# EAGLE design DoorchimeCR2B (EAGLE 6.5.0)

## Sheet 1 of 3
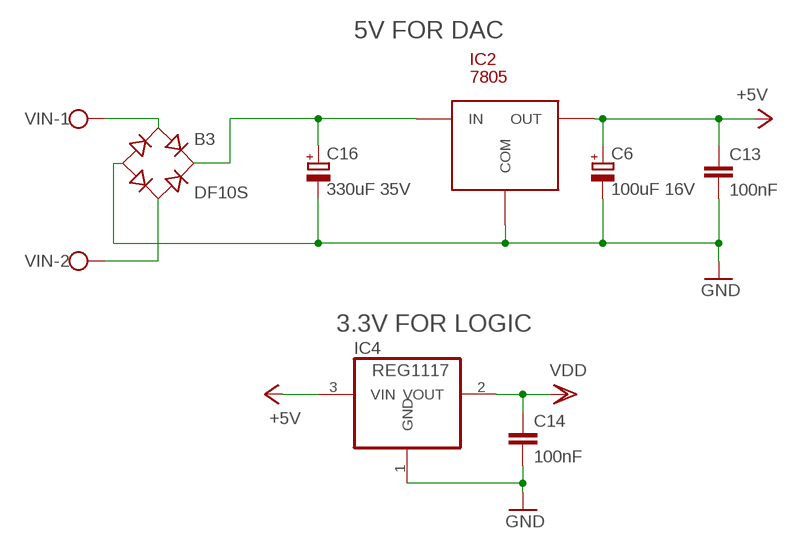
[diagram p0: schematic, sheet 1]

### Parts
B3  DF10S  [DFS]
C6  100uF 16V  CPOL-EU153CLV-0605  [153CLV-0605]
C13  100nF  C-EUC0603  [C0603]
C14  100nF  C-EUC0603  [C0603]
C16  330uF 35V  CPOL-EU153CLV-0807  [153CLV-0807]
IC2  7805  78XX-D2PAK  [D2PAK]
IC4  REG1117  [SOT223]
VIN  W237-102  [W237-102]

### Nets
+5V: C6.+ C13.1 IC2.OUT IC4.3(VIN) ; also sheet 3
GND [analog_pwr]: B3.- C6.- C13.2 C14.2 C16.- IC2.COM IC4.1(GND) ; also sheet 2,3
VDD: C14.1 IC4.2(VOUT) ; also sheet 2
VIN1 [system_pwr]: B3.AC1 VIN.1
VIN2: B3.AC2 VIN.2
VIN+: B3.+ C16.+ IC2.IN

### Notes on the sheet
- 5V FOR DAC
- 3.3V FOR LOGIC

## Sheet 2 of 3: Logic
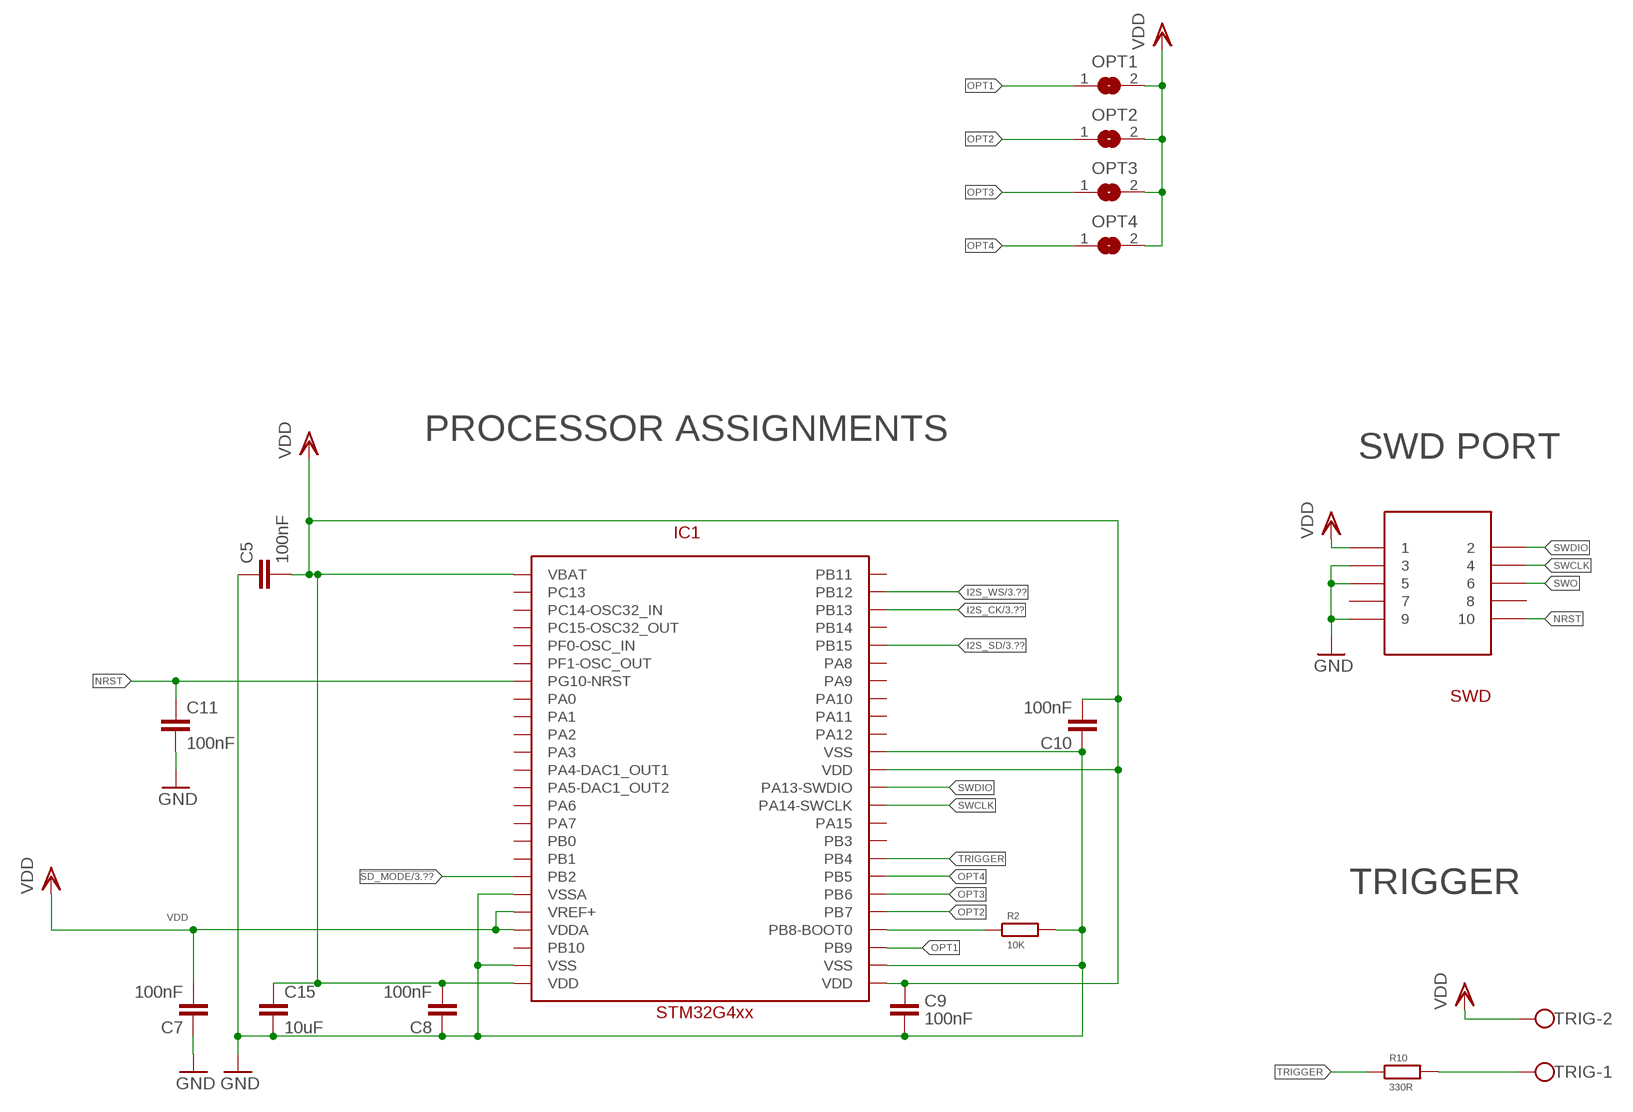
[diagram p1: schematic, sheet 2]

### Parts
C5  100nF  C-EUC0603  [C0603]
C7  100nF  C-EUC0603  [C0603]
C8  100nF  C-EUC0603  [C0603]
C9  100nF  C-EUC0603  [C0603]
C10  100nF  C-EUC0603  [C0603]
C11  100nF  C-EUC0603  [C0603]
C15  10uF  C-EUC0603  [C0603]
IC1  STM32G4xx  STM32G431-C8T6  [TQFP48]
OPT1  SJ  [SJ]
OPT2  SJ  [SJ]
OPT3  SJ  [SJ]
OPT4  SJ  [SJ]
R2  10K  R-EU_R0603  [R0603]
R10  330R  R-EU_R0603  [R0603]
SWD  FTSH-105-01  [FTSH-105-01-XXX-DV-K]
TRIG  W237-102  [W237-102]

### Nets
!SD_MODE: IC1.PB2 ; also sheet 3
BOOT0: IC1.PB8-BOOT0 R2.1
GND [analog_pwr]: C5.1 C7.1 C8.1 C9.1 C10.1 C11.2 C15.2 IC1.VSS@23(VSS) IC1.VSS@35(VSS) IC1.VSS@47(VSS) IC1.VSSA R2.2 SWD.3 SWD.5 SWD.9 ; also sheet 1,3
I2S_CK: IC1.PB13 ; also sheet 3
I2S_SD: IC1.PB15 ; also sheet 3
I2S_WS: IC1.PB12 ; also sheet 3
NRST: C11.1 IC1.PG10-NRST SWD.10
OPT1: IC1.PB9 OPT1.1
OPT2: IC1.PB7 OPT2.1
OPT3: IC1.PB6 OPT3.1
OPT4: IC1.PB5 OPT4.1
SWCLK: IC1.PA14-SWCLK SWD.4
SWDIO: IC1.PA13-SWDIO SWD.2
SWO: SWD.6
TRIG1: R10.2 TRIG.1
TRIGGER: IC1.PB4 R10.1
VDD: C5.2 C7.2 C8.2 C9.2 C10.2 C15.1 IC1.VBAT IC1.VDD@24(VDD) IC1.VDD@36(VDD) IC1.VDD@48(VDD) IC1.VDDA IC1.VREF+ OPT1.2 OPT2.2 OPT3.2 OPT4.2 SWD.1 TRIG.2 ; also sheet 1
Unconnected: IC1.PA0 IC1.PA1 IC1.PA2 IC1.PA3 IC1.PA4-DAC1_OUT1 IC1.PA5-DAC1_OUT2 IC1.PA6 IC1.PA7 IC1.PA8 IC1.PA9 IC1.PA10 IC1.PA11 IC1.PA12 IC1.PA15 IC1.PB0 IC1.PB1 IC1.PB3 IC1.PB10 IC1.PB11 IC1.PB14 IC1.PC13 IC1.PC14-OSC32_IN IC1.PC15-OSC32_OUT IC1.PF0-OSC_IN IC1.PF1-OSC_OUT SWD.7 SWD.8

### Notes on the sheet
- PROCESSOR ASSIGNMENTS
- SWD PORT
- TRIGGER

## Sheet 3 of 3: Speaker Output
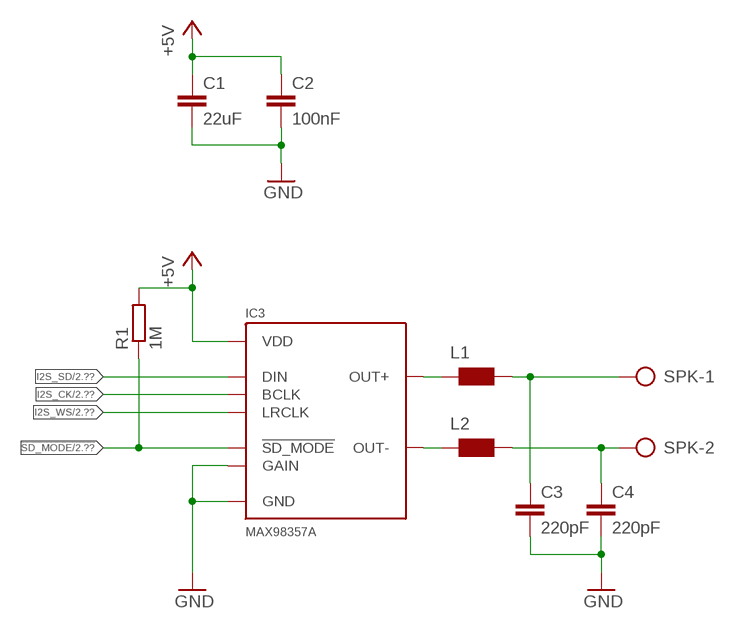
[diagram p2: schematic, sheet 3]

### Parts
C1  22uF  C-EUC0603  [C0603]
C2  100nF  C-EUC0603  [C0603]
C3  220pF  C-EUC0603  [C0603]
C4  220pF  C-EUC0603  [C0603]
IC3  MAX98357A  [TQFN-16]
L1  WE-CBF_0603  [0603]
L2  WE-CBF_0603  [0603]
R1  1M  R-EU_R0603  [R0603]
SPK  W237-102  [W237-102]

### Nets
!SD_MODE: IC3.P$4(!SD_MODE) R1.1 ; also sheet 2
+5V: C1.1 C2.1 IC3.P$7(VDD) IC3.P$8(VDD) R1.2 ; also sheet 1
GND [analog_pwr]: C1.2 C2.2 C3.2 C4.2 IC3.P$2(GAIN) IC3.P$3(GND) IC3.P$11(GND) IC3.P$15(GND) IC3.P$EP(GND) ; also sheet 1,2
I2S_CK: IC3.P$16(BCLK) ; also sheet 2
I2S_SD: IC3.P$1(DIN) ; also sheet 2
I2S_WS: IC3.P$14(LRCLK) ; also sheet 2
N$1 [system_pwr]: IC3.P$9(OUT+) L1.1
N$2 [system_pwr]: IC3.P$10(OUT-) L2.1
N$3 [system_pwr]: C4.1 L2.2 SPK.2
N$4 [system_pwr]: C3.1 L1.2 SPK.1

## Library data of the parts
B3 = rectifier:DF*S: Surface Mount Glass Passivated Bridge Rectifiers Source: Source: Comchip Bridge Rectifiers DF005S-G thru DF10S-G.pdf
C1-C5 C7-C11 C13-C15 = rcl:C-EU: CAPACITOR, European symbol
C6 C16 = rcl:CPOL-EU: POLARIZED CAPACITOR, European symbol
IC1 = STM32G431:STM32G431-C8T6: STM32G431C8T6 64K of FLASH, 32K or RAM, 170MHz Cortex M4 with single precision floating point unit. Also, Two DACs.
IC2 = 78XXCD2T:78XX-D2PAK
IC3 = SparkFun-IC-Amplifiers:MAX98357A: I2S DAC 3.2W (4-8ohm); PROD_ID: IC-14032
IC4 = burr-brown:REG1117: 800mA and 1A Low Dropout (LDO) Positive Regulator 1.8V, 2.5V, 2.85V, 3.3V, 5V, and Adj; MPN: REG1117; OC_FARNELL: 1097566; OC_NEWARK: 14P6981
L1 L2 = wuerth-elektronik:WE-CBF: SMD EMI Suppression Ferrite Beads - excellent anti-EMI properties - low DCR - impedances till 3000 ohms - rated current up to 6 A
OPT1-OPT4 = jumper:SJ: SMD solder JUMPER
R1 R2 R10 = rcl:R-EU_: RESISTOR, European symbol
SPK TRIG VIN = con-wago-500:W237-102: WAGO SCREW CLAMP; MPN: 237-102; OC_FARNELL: unknown; OC_NEWARK: 70K9898
SWD = Con-Samtech (Duncs):FTSH-105-01

## Net classes
0 sgnal: width 0.152 mm, clearance 0.305 mm
1 analog_pwr: width 0.61 mm, clearance 0.406 mm
2 analog_sig: width 0.152 mm, clearance 0.457 mm
3 system_pwr: width 0.889 mm, clearance 0.457 mm

## Board
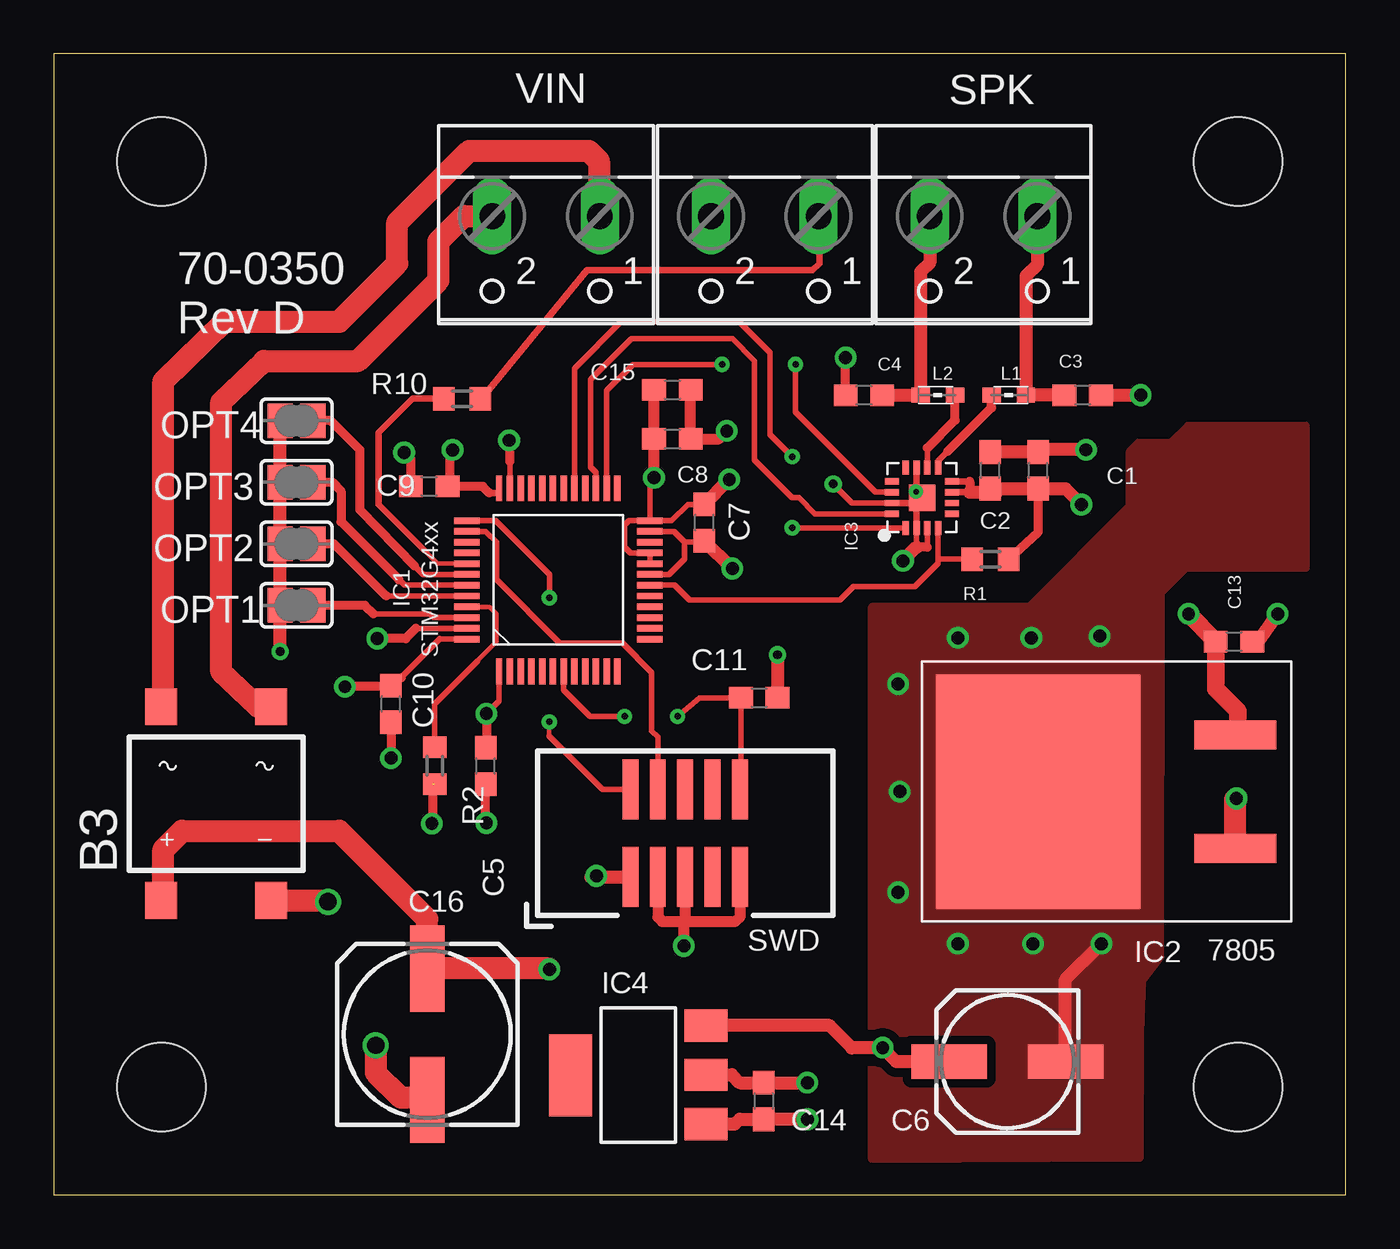
[diagram p3: board, top side]
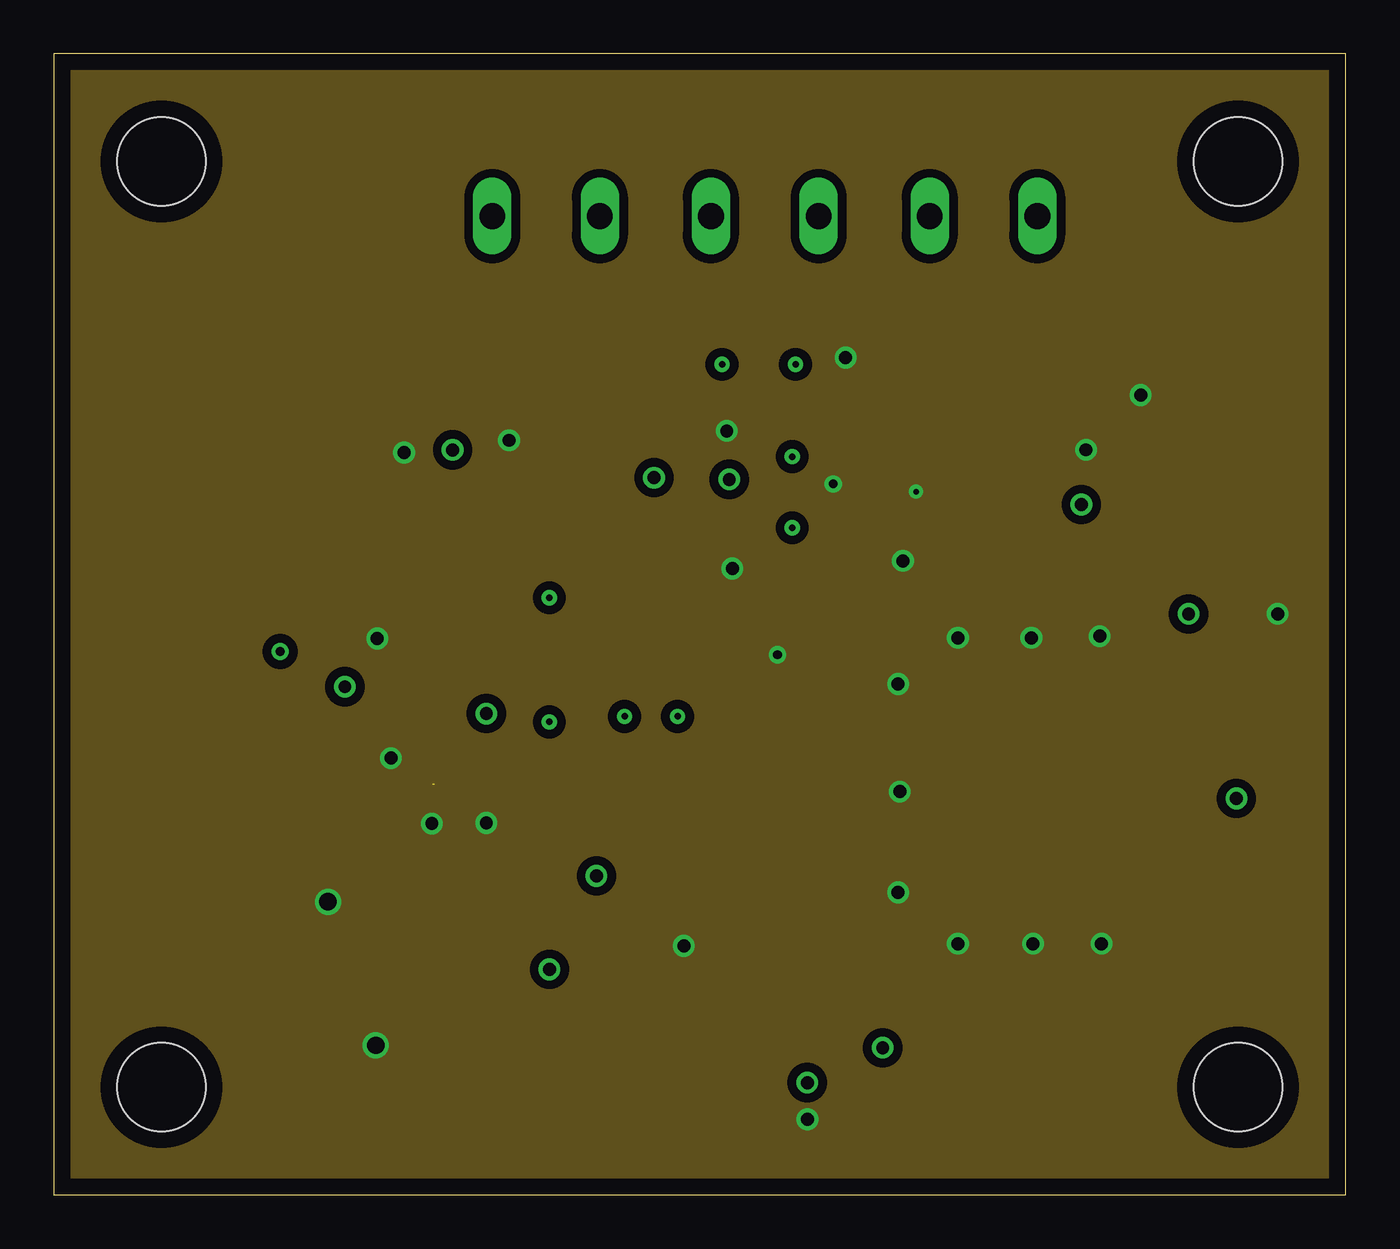
[diagram p4: board, inner layer Route2]
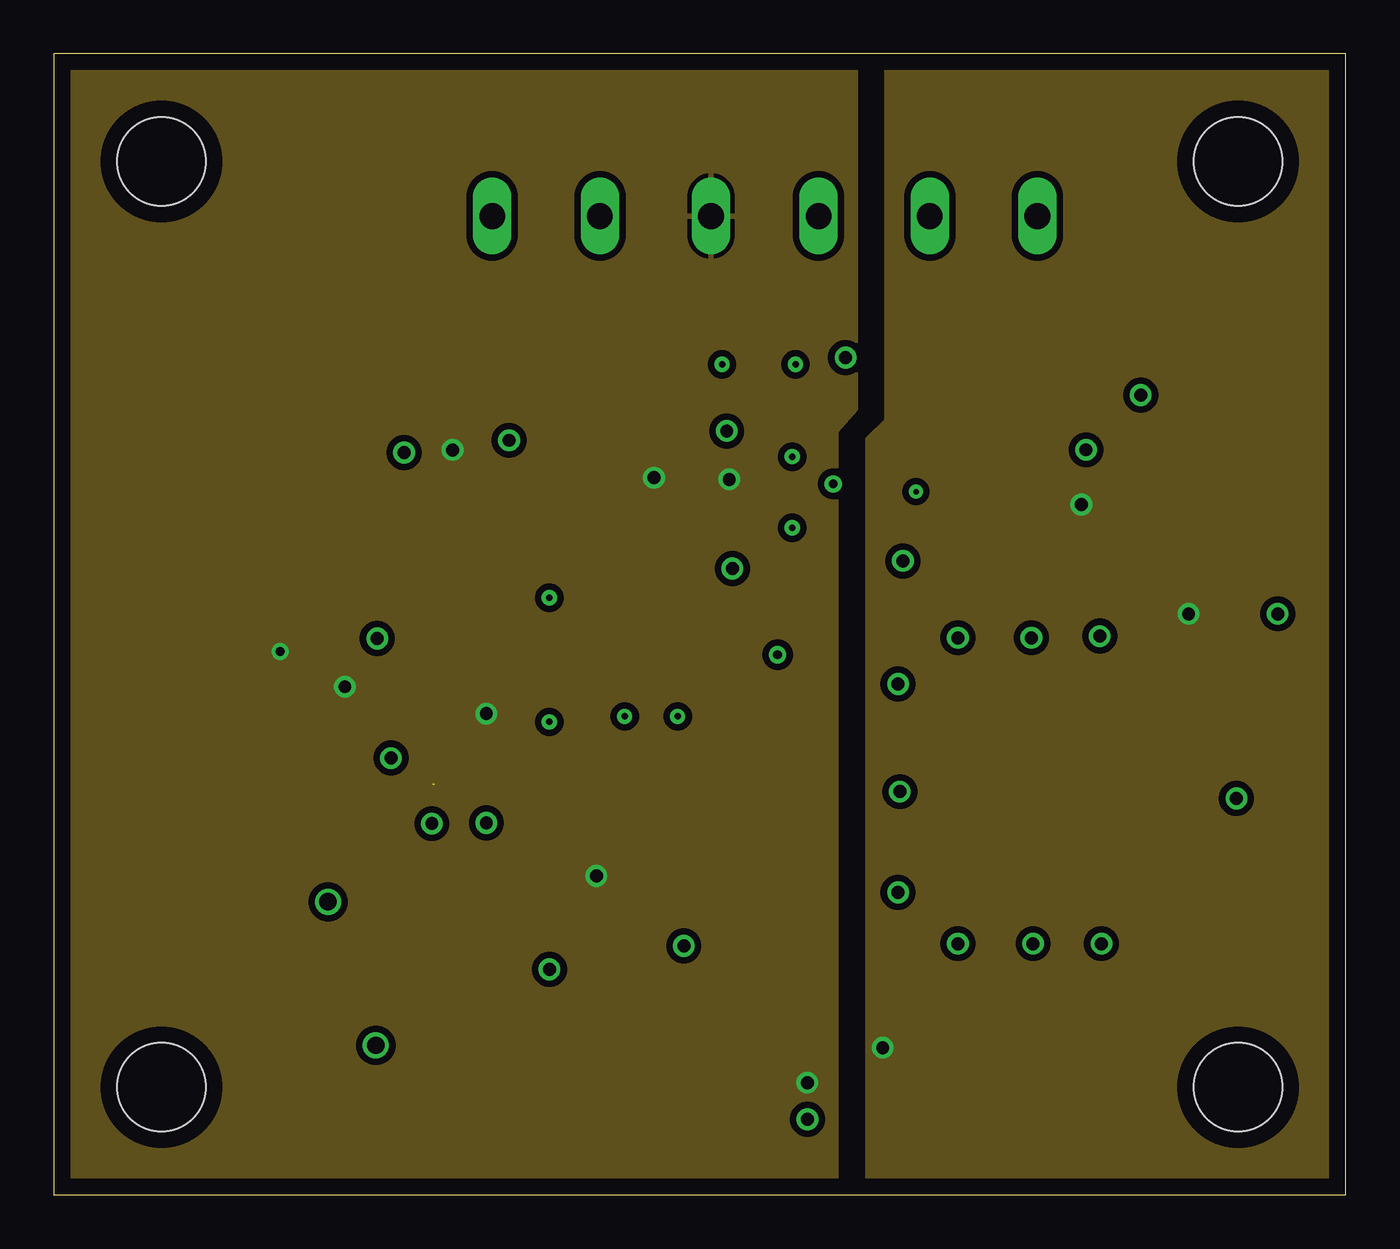
[diagram p5: board, inner layer Route15]
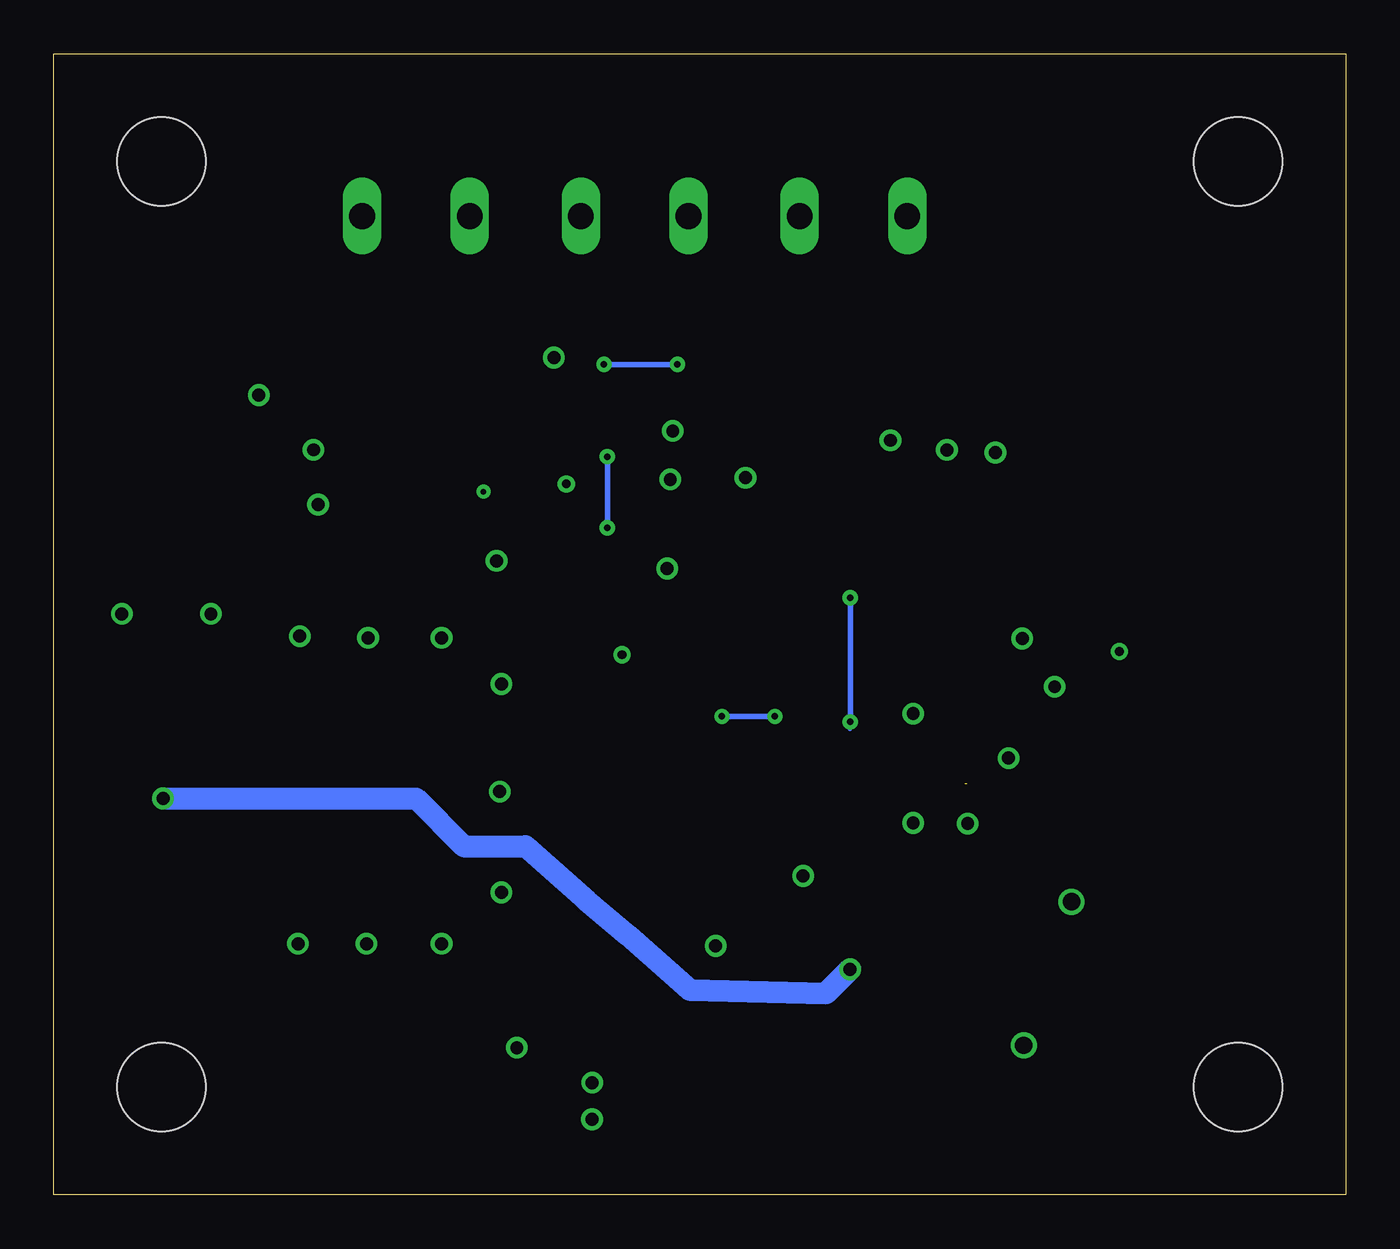
[diagram p6: board, bottom side, seen from below]

Size 60 x 53 mm. Coordinates in mm from the lower left corner, seen from the top.
Outline: 0,0 60,0 60,53 0,53 0,0
Copper layers ((1+2)*(15+16)): Top 0.035mm / dielectric 0.78mm / Route2 0.035mm / dielectric 0.1mm / Route15 0.035mm / dielectric 0.78mm / Bottom 0.035mm
Design rules "default *": minimum track width 6mil, minimum drill 0.3mm, track to track 3mil, track to pad 3mil, pad to pad 3mil, via to via 3mil, smd to smd 3mil, copper to edge 30mil, drill to drill 8mil, minimum pad ring 10mil, minimum via ring 8mil, stop-mask expansion 2.5mil, vias tented up to drill 0mil, thermal gap 8mil
Holes 4.1 mm at 5,5 55,5 55,48 5,48

### Footprints (pad centres in the part's own frame; a part is rotated, then mirrored left to right if it is on the bottom)
DFS = smd 1.5 x 1.7: + -2.55,-4.5; - 2.55,-4.5; AC1 -2.55,4.5; AC2 2.55,4.5
C0603 = smd 1.1 x 1: 1 -0.85,0; 2 0.85,0
153CLV-0605 = smd 3.5 x 1.6: + 2.7,0; - -2.7,0
153CLV-0807 = smd 4 x 1.6: + 3.05,0; - -3.05,0
TQFP48 = smd 1.2 x 0.3: PA0 -4.25,-0.75; PA1 -4.25,-1.25; PA2 -4.25,-1.75; PA3 -4.25,-2.25; PA4-DAC1_OUT1 -4.25,-2.75; PA8 4.25,-0.25; PA9 4.25,0.25; PA10 4.25,0.75; PA11 4.25,1.25; PA12 4.25,1.75; PB11 4.25,-2.75; PB12 4.25,-2.25; PB13 4.25,-1.75; PB14 4.25,-1.25; PB15 4.25,-0.75; PC13 -4.25,2.25; PC14-OSC32_IN -4.25,1.75; PC15-OSC32_OUT -4.25,1.25; PF0-OSC_IN -4.25,0.75; PF1-OSC_OUT -4.25,0.25; PG10-NRST -4.25,-0.25; VBAT -4.25,2.75; VDD@36 4.25,2.75; VSS@35 4.25,2.25 | smd 0.3 x 1.2: PA5-DAC1_OUT2 -2.75,-4.25; PA6 -2.25,-4.25; PA7 -1.75,-4.25; PA13-SWDIO 2.75,4.25; PA14-SWCLK 2.25,4.25; PA15 1.75,4.25; PB0 -1.25,-4.25; PB1 -0.75,-4.25; PB2 -0.25,-4.25; PB3 1.25,4.25; PB4 0.75,4.25; PB5 0.25,4.25; PB6 -0.25,4.25; PB7 -0.75,4.25; PB8-BOOT0 -1.25,4.25; PB9 -1.75,4.25; PB10 1.75,-4.25; VDD@24 2.75,-4.25; VDD@48 -2.75,4.25; VDDA 1.25,-4.25; VREF+ 0.75,-4.25; VSS@23 2.25,-4.25; VSS@47 -2.25,4.25; VSSA 0.25,-4.25
D2PAK = smd 10.9 x 9.5: COM 0,0 | smd 1.35 x 3.81: IN -2.64,-9.15; OUT 2.64,-9.15
TQFN-16 = smd 0.3 x 0.65: P$1 -0.75,-1.4; P$2 -0.25,-1.4; P$3 0.25,-1.4; P$4 0.75,-1.4; P$9 0.75,1.4; P$10 0.25,1.4; P$11 -0.25,1.4; P$12 -0.75,1.4 | smd 0.65 x 0.3: P$5 1.4,-0.75; P$6 1.4,-0.25; P$7 1.4,0.25; P$8 1.4,0.75; P$13 -1.4,0.75; P$14 -1.4,0.25; P$15 -1.4,-0.25; P$16 -1.4,-0.75 | smd 1.23 x 1.23: P$EP 0,0
SOT223 = smd 1.499 x 2.007: 1 -2.261,-3.15; 2 0.025,-3.15; 3 2.311,-3.15 | smd 3.81 x 2.007: 4 0,3.15
0603 = smd 0.85 x 0.7: 1 -0.9,0; 2 0.7,0
SJ = smd 1.168 x 1.6: 1 -0.762,0; 2 0.762,0
R0603 = smd 1 x 1.1: 1 -0.85,0; 2 0.85,0
W237-102 = drill 1.194 long: 1 -2.5,-1.27; 2 2.5,-1.27
FTSH-105-01-XXX-DV-K = smd 0.737 x 2.794: 1 -2.54,-2.032; 2 -2.54,2.032; 3 -1.27,-2.032; 4 -1.27,2.032; 5 0,-2.032; 6 0,2.032; 7 1.27,-2.032; 8 1.27,2.032; 9 2.54,-2.032; 10 2.54,2.032

### Placement (x,y rotation side)
B3  7.54,18.18 0 top
C1  45.72,33.66 90 top
C2  43.5,33.66 90 top
C3  47.78,37.15 0 top
C4  37.62,37.15 180 top
C5  20.06,19.93 90 top
C6  44.29,6.19 180 top
C7  30.22,31.23 90 top
C8  28.73,35.11 180 top
C9  17.44,32.91 0 top
C10  15.66,22.8 90 top
C11  32.76,23.08 0 top
C13  54.81,25.7 0 top
C14  32.97,4.36 270 top
C15  28.73,37.39 0 top
C16  17.35,7.46 90 top
IC1  23.43,28.57 90 top
IC2  45.72,18.73 90 top
IC3  40.32,32.38 0 top
IC4  27.15,5.56 90 top
L1  44.45,37.15 0 top
L2  40.96,37.15 180 top
OPT1  11.27,27.38 180 top
OPT2  11.27,30.24 180 top
OPT3  11.27,33.1 180 top
OPT4  11.27,35.96 180 top
R1  43.5,29.53 0 top
R2  17.69,19.93 270 top
R10  18.96,36.98 0 top
SPK  43.18,44.19 180 top
SWD  29.32,16.8 0 top
TRIG  33.02,44.19 180 top
VIN  22.86,44.19 180 top

### Tracks (layer width: path | path; a pad name or v marks a point on that pad's centre or on a via)
!SD_MODE
  Top 0.254: 41.07,30.36 IC3.P$4 41.07,29.53 | IC1.PB2 28.83,28.32 29.53,27.62 36.51,27.62 37.15,28.26 40.01,28.26 41.07,29.32 41.07,29.53 | R1.1 41.07,29.53
+5V  (via drill 0.6)
  Top 0.305: IC3.P$7 42.55,32.63 | 43.78,32.63 C2.1 | IC3.P$8 42.55,33.13
  Top 0.406: 42.55,33.13 42.55,32.63 | R1.2 45.72,30.8 C1.1
  Top 0.61: 42.55,32.63 43.78,32.63 | C2.1 C1.1 46.99,32.8 v47.73,32.07 | IC4.3 36.03,7.87 37.07,6.83 v38.5,6.84 38.58,6.75 39.13,6.19 C6.+
  Top 0.813: v52.7,26.99 53.94,25.72 C13.1 53.98,25.68 53.98,23.5 54.98,22.49 54.98,21.26
  Top 1.016: IC2.OUT 54.98,21.26
  pour Route15: 60,0 60,53 38.67,53 38.67,35.96 37.8,35.12 37.8,0
BOOT0
  Top 0.203: IC1.PB8-BOOT0 20.23,27.32 20.57,26.98 20.57,25.71 19.69,24.82 19.69,24.8
  Top 0.254: 19.69,24.8 17.69,22.8 R2.1
GND  (via drill 0.25 pad 0.51, 0.4, 0.6, 0.6 pad 0.35, 0.8)  (1 unrouted)
  Top 0.254: IC1.VSS@35 21.18,34.08 | IC1.VSS@47 16.81,26.32 | IC1.VSS@23 28.79,30.82 29.29,30.32 | 29.29,30.32 30.16,30.32 C7.1 30.23,30.36 | IC1.VSSA 28.58,28.82 29.29,29.53 29.29,30.32 | IC3.P$2 40.07,30.08 | IC3.P$3 40.57,30.08 | v33.61,25.08 33.61,25.05 | IC3.P$15 37.08,32.13 v36.2,33.02
  Top 0.305: IC3.P$EP 40.07,32.38 IC3.P$2 | IC3.P$15 40.32,32.13 IC3.P$EP | IC3.P$11 40.07,32.63 v40.04,32.66 IC3.P$EP
  Top 0.406: 21.18,34.08 21.18,34.39 v21.14,35.05 | 29.26,12.69 29.38,12.69 29.32,12.88 | 31.88,14.75 SWD.9 | v20.09,17.28 20.06,17.45 C5.1 | 16.81,26.32 16.34,25.84 v15.02,25.84 | C9.1 16.59,34.16 v16.27,34.48 | 46.14,34.61 C1.2 | 40.57,30.08 40.07,30.08 | C4.2 v36.77,38.89 | 17.6,19.09 17.6,17.29 v17.56,17.25 | C10.1 v15.66,20.29
  Top 0.508: SWD.3 28.05,12.9 28.26,12.69 29.26,12.69 v29.26,11.57 | 29.38,12.69 31.63,12.69 31.88,12.94 31.88,14.75 | SWD.5 29.32,12.88 | C15.2 C8.1 30.88,35.11 v31.25,35.48
  Top 0.61: C13.2 55.74,25.82 55.96,25.72 v56.84,26.99 | v31.52,29.09 30.23,30.36 | C1.2 C2.2 | v47.94,34.61 46.14,34.61 | 40.07,30.08 v39.44,29.45 | C3.2 v50.48,37.15 | 33.61,25.05 C11.2 | v35,3.51 C14.2 31.85,3.51 31.63,3.3 IC4.1 | C6.- 46.99,10 v48.66,11.67
  Top 1.016: v14.96,6.95 14.96,5.68 16.11,4.52 17.39,4.52 C16.- | B3.- 12.67,13.68 v12.73,13.62
  other vias: 39.21,14.05 45.48,11.67 41.99,11.67 45.4,25.88 41.99,25.88 39.29,18.73 39.21,23.73 48.58,25.96
  pour Route2: 0,53 60,53 60,0 0,0
  pour Top (no thermals): 38.02,27.3 45.32,27.3 50.01,31.99 50.01,34.53 50.4,34.92 51.91,34.92 52.7,35.72 58.1,35.72 58.1,29.13 52.55,29.13 51.37,27.96 51.36,11.03 50.5,9.94 50.42,7.54 50.4,1.75 38.02,1.67
I2S_CK
  Top 0.254: IC1.PB13 25.18,33.56 24.92,33.81 24.92,37.86 26.83,39.77 31.51,39.77 32.54,38.73 32.54,34.13 34.29,32.38 34.61,32.38 35.36,31.64 IC3.P$16
I2S_SD  (via drill 0.3)
  Top 0.254: v34.29,34.29 33.26,35.32 33.26,39.13 31.83,40.56 26.35,40.56 24.18,38.39 IC1.PB15 | v34.29,30.98 IC3.P$1
  Bottom 0.254: v34.29,34.29 v34.29,30.98
I2S_WS  (via drill 0.3)
  Top 0.254: IC3.P$14 38.17,32.63 34.45,36.35 v34.45,38.58 | IC1.PB12 25.68,37.35 26.91,38.58 v31.04,38.58
  Bottom 0.254: v31.04,38.58 v34.45,38.58
N$1
  Top 0.254: IC3.P$9 41.07,34.09 41.51,34.53 | 43.5,37.09 L1.1
  Top 0.406: 41.51,34.53 43.55,36.56 L1.1
N$2
  Top 0.254: IC3.P$10 40.57,34.7
  Top 0.406: 40.57,34.7 41.86,35.98 L2.1
N$3
  Top 0.61: C4.1 L2.2 40.26,42.88 40.68,43.3 SPK.2
N$4
  Top 0.61: C3.1 L1.2 45.15,42.69 45.68,43.22 SPK.1
NRST  (via drill 0.3)
  Top 0.254: IC1.PG10-NRST 23.68,23.45 24.9,22.23 v26.51,22.23 | 31.92,18.81 C11.1 | v28.97,22.23 29.99,23.08 C11.1
  Top 0.305: 31.92,18.81 SWD.10 | C11.1
  Top 0.406: SWD.10 31.83,18.83
  Bottom 0.254: v26.51,22.23 v28.97,22.23
OPT1
  Top 0.254: IC1.PB9 17.63,26.82 17.46,26.99 14.84,26.99
  Top 0.406: OPT1.1 14.45,27.38 14.84,26.99
OPT2
  Top 0.254: IC1.PB7 15.44,27.82
  Top 0.406: OPT2.1 13.02,30.24 15.44,27.82
OPT3
  Top 0.254: IC1.PB6 16.29,28.32 16.03,28.57
  Top 0.406: OPT3.1 12.94,33.1 13.34,32.7 13.34,31.27 16.03,28.57
OPT4
  Top 0.254: IC1.PB5 17.14,28.82 16.75,29.21
  Top 0.406: OPT4.1 12.86,35.96 14.21,34.61 14.21,31.83 16.75,29.21
SWCLK
  Top 0.254: SWD.4 28.05,21.27 27.77,21.56 27.77,24.28 26.41,25.64 23.5,25.64 20.56,28.57 20.56,30.32 20.06,30.82 IC1.PA14-SWCLK
SWDIO  (via drill 0.3 pad 0.35)
  Top 0.203: 23.01,21.31 v23.01,21.97
  Top 0.254: 23.01,21.31 25.48,18.83 SWD.2 | IC1.PA13-SWDIO 20.51,31.32 23.02,28.81 23.02,27.74 v23.01,27.73
  Bottom 0.203: 23.02,21.64 | 23.02,21.64 v23.01,21.97
  Bottom 0.254: v23.01,27.73 v23.01,21.97
TRIG1
  Top 0.305: TRIG.1 35.56,45.42 35.56,43.26 35.24,42.94 24.77,42.94 20,37.15 19.98,37.15 R10.2
TRIGGER
  Top 0.203: IC1.PB4 17.83,29.32 17.16,29.98
  Top 0.305: R10.1 16.66,36.98 15.08,35.4 15.08,32.06 17.16,29.98
VDD  (via drill 0.4 pad 0.25, 0.6 pad 0.35)
  Top 0.203: 20.64,32.6 20.68,32.64 IC1.VDD@36
  Top 0.254: 17.92,25.82 IC1.VDD@48 | IC1.VDD@24 27.68,33.11 | IC1.VREF+ IC1.VDDA 26.78,29.82 26.51,30.08 26.51,31.11 26.71,31.32 IC1.VDD@24 | IC1.VDD@24 28.7,31.32 29.45,32.07 30.21,32.07 C7.2 | IC1.VBAT 20.68,22.95 v20.09,22.36
  Top 0.305: C10.2 15.64,23.61 | 17.92,25.82 16.14,24.03 | 20.64,32.6 20.22,32.6 | 27.68,33.11 arc-90 v27.88,33.31
  Top 0.406: 26.76,14.75 SWD.1 | 15.64,23.61 v13.52,23.61 | 16.14,24.03 C10.2 | 20.22,32.6 19.92,32.91 C9.2 18.39,33.14 18.39,34.48 v18.52,34.6 | v20.09,22.36 20.09,20.8 C5.2
  Top 0.508: v27.88,33.31 27.88,35.42 arc90 C8.2 C15.1
  Top 0.61: v25.2,14.82 24.93,14.77 SWD.1 | 31.35,33.18 31.32,33.18 C7.2 | OPT4.2 OPT3.2 OPT2.2 OPT1.2 v10.51,25.24 | v34.99,5.21 C14.1 31.85,5.21 31.49,5.58 IC4.2
  other vias: 31.37,33.23
  pour Route15: 37.25,53 37.25,36.5 36.36,35.47 36.36,-0.03 0,0 0,53
VIN1
  Top 1.016: B3.AC1 5.08,22.77 5.08,37.78 7.94,40.56 13.26,40.56 15.95,43.26 15.95,45.16 19.29,48.5 24.84,48.5 25.32,48.02 25.32,45.5 VIN.1
VIN2
  Top 1.016: VIN.2 19.03,45.46 17.86,44.29 17.86,42.47 14.13,38.73 9.76,38.73 7.78,36.83 7.78,24.29 9.47,22.68 B3.AC2
VIN+  (via drill 0.6)
  Top 1.016: IC2.IN 54.87,18.36 v54.93,18.41 | v23.02,10.48 22.98,10.51 C16.+ 17.35,12.82 13.26,16.91 5.95,16.91 5.08,16.03 5.08,13.59 B3.+
  Bottom 1.016: v54.93,18.41 43.18,18.41 40.96,16.19 38.1,16.19 35.24,13.65 33.34,12.06 30.48,9.53 24.13,9.37 v23.02,10.48

### Text on the board
tNames: 70-0350 / Rev D
tValues: + | -